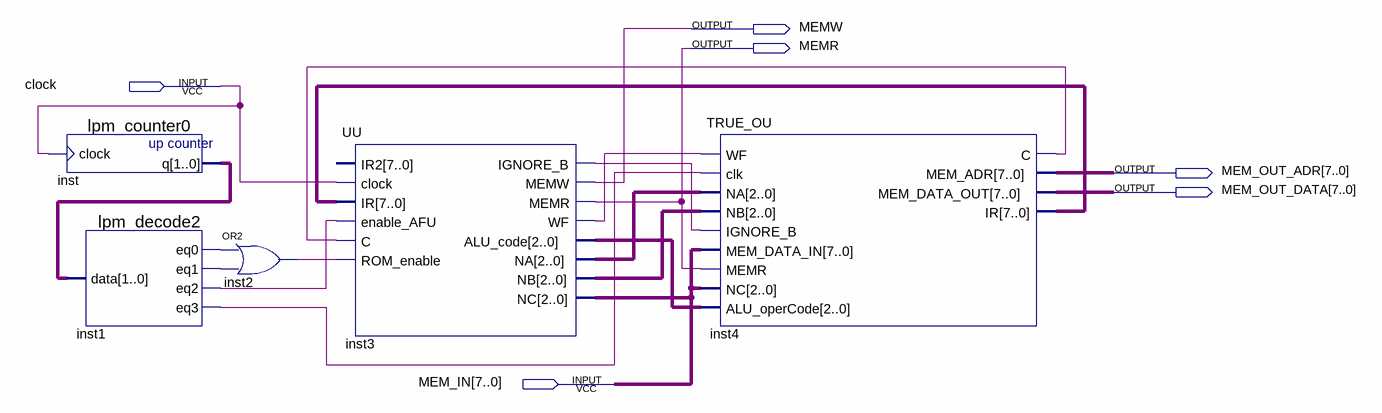
[diagram p0: schematic sheet]
// Quartus schematic CPU.bdf as structural Verilog: 5 symbols, 6 pins
module CPU (
  input  clock,
  input  [7:0] MEM_IN,
  output MEMW,
  output MEMR,
  output [7:0] MEM_OUT_ADR,
  output [7:0] MEM_OUT_DATA
);

  wire inst1_eq0, inst1_eq1, inst1_eq2, inst1_eq3, inst2_out, inst3_ignore_b, inst3_wf, inst4_c;
  wire [1:0] inst_q;
  wire [2:0] inst3_alu_code, inst3_na, inst3_nb;
  wire [7:0] inst4_ir;

  lpm_counter0 inst (.clock(clock), .q(inst_q));
  lpm_decode2 inst1 (.data(inst_q), .eq0(inst1_eq0), .eq1(inst1_eq1), .eq2(inst1_eq2), .eq3(inst1_eq3));
  or inst2 (inst2_out, inst1_eq0, inst1_eq1);
  UU inst3 (
    .clock(clock), .IR(inst4_ir), .enable_AFU(inst1_eq2), .C(inst4_c), .ROM_enable(inst2_out),
    .IGNORE_B(inst3_ignore_b), .MEMW(MEMW), .MEMR(MEMR), .WF(inst3_wf), .ALU_code(inst3_alu_code),
    .NA(inst3_na), .NB(inst3_nb), .NC(MEM_IN));  // open: IR2
  TRUE_OU inst4 (
    .WF(inst3_wf), .clk(inst1_eq3), .NA(inst3_na), .NB(inst3_nb), .IGNORE_B(inst3_ignore_b),
    .MEM_DATA_IN(MEM_IN), .MEMR(MEMR), .NC(MEM_IN), .ALU_operCode(inst3_alu_code), .C(inst4_c),
    .MEM_ADR(MEM_OUT_ADR), .MEM_DATA_OUT(MEM_OUT_DATA), .IR(inst4_ir));
endmodule
